# EAGLE schematic TiltyDuo (EAGLE 6.4)
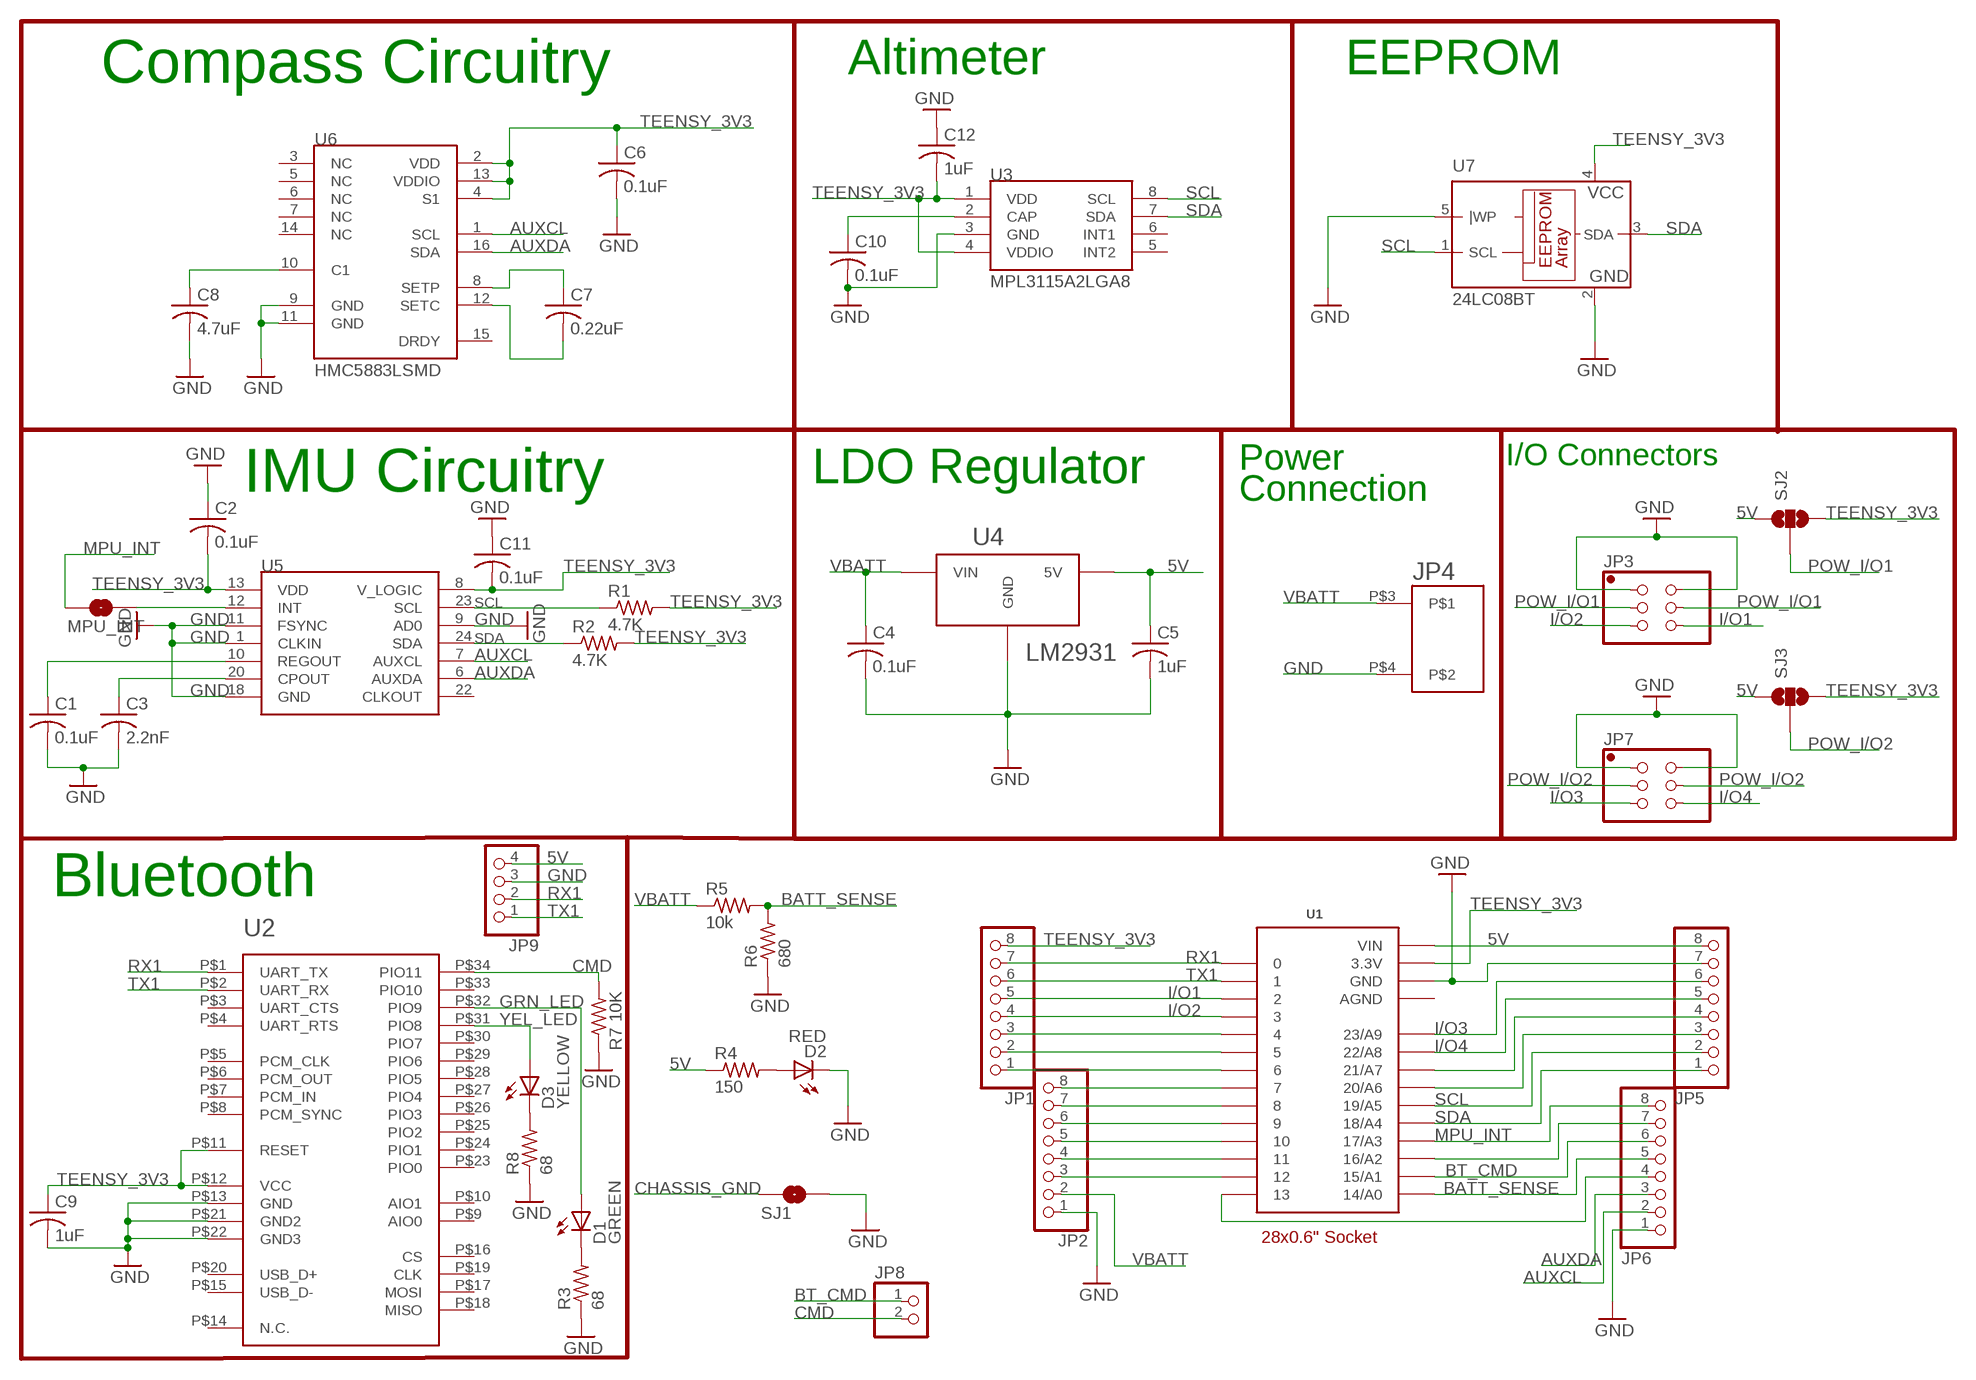
[diagram p0: schematic, sheet 1]

## Parts
C1  0.1uF  C-USC0603  [C0603]
C2  0.1uF  C-USC0603  [C0603]
C3  2.2nF  C-USC0603  [C0603]
C4  0.1uF  C-USC0603  [C0603]
C5  1uF  C-USC0603  [C0603]
C6  0.1uF  C-USC0603  [C0603]
C7  0.22uF  C-USC0603  [C0603]
C8  4.7uF  C-USC0603  [C0603]
C9  1uF  C-USC0603  [C0603]
C10  0.1uF  C-USC0603  [C0603]
C11  0.1uF  C-USC0603  [C0603]
C12  1uF  C-USC0603  [C0603]
D1  GREEN  LED-GREENLED-0805_NO_SILK  [LED-0805]
D2  RED  LED-GREENLED-0805_NO_SILK  [LED-0805]
D3  YELLOW  LED-GREENLED-0805_NO_SILK  [LED-0805]
JP1  PINHD-1X81X08_NO_SILK  [1X08_NO_SS]
JP2  PINHD-1X81X08_NO_SILK  [1X08_NO_SS]
JP3  PINHD-2X32X03_NO_SILK  [2X03_NO_SS]
JP4  2-POS_SMD_TERM_BLOCK  [2-POS_SMD_TERMINAL_BLOCK]
JP5  PINHD-1X81X08_NO_SILK  [1X08_NO_SS]
JP6  PINHD-1X81X08_NO_SILK  [1X08_NO_SS]
JP7  PINHD-2X32X03_NO_SILK  [2X03_NO_SS]
JP8  PINHD-1X21X02_NO_SILK  [1X02_NO_SS]
JP9  PINHD-1X4  [1X04]
MPU_INT  SOLDERJUMPERNO  [SJ_2S-NO]
R1  4.7K  R-US_R0402  [R0402]
R2  4.7K  R-US_R0402  [R0402]
R3  68  R-US_R0603  [R0603]
R4  150  R-US_R0603  [R0603]
R5  10k  R-US_R0603  [R0603]
R6  680  R-US_R0603  [R0603]
R7  10K  R-US_R0603  [R0603]
R8  68  R-US_R0603  [R0603]
SJ1  SOLDERJUMPERNO  [SJ_2S-NO]
SJ2  SOLDERJUMPER_2WAYS  [SJ_3]
SJ3  SOLDERJUMPER_2WAYS  [SJ_3]
U1  TEENSY_3.0_OUTER-PINS28-DIP_SOCKET  [28-DIP]
U2  HC-09_BREAKOUT  [HC-09_BREAKOUT]
U3  MPL3115A2LGA8  [LGA8]
U4  LM2931  [TO263]
U5  MPU-6050  [QFN-24]
U6  HMC5883LSMD  [16LPCC]
U7  24LC08BT  [SOT23-5L]

## Nets
5V: C5.1 JP5.8 JP9.4 R4.1 SJ2.1 SJ3.1 U1.P$15(VIN) U4.P$3(5V)
AUXCL [I/O]: JP6.2 U5.7(AUXCL) U6.1(SCL)
AUXDA [I/O]: JP6.3 U5.6(AUXDA) U6.16(SDA)
BATT_SENSE: JP6.5 R5.2 R6.2 U1.P$27(14/A0)
BT_CMD: JP6.6 JP8.1 U1.P$26(15/A1)
CHASSIS_GND: SJ1.1
CMD: JP8.2 R7.2 U2.P$34(PIO11)
GND: C1.2 C2.1 C3.2 C4.2 C5.2 C6.2 C8.2 C9.2 C10.2 C11.1 C12.1 D2.2(C) JP2.1 JP3.1 JP3.2 JP4.P$4 JP5.7 JP6.1 JP7.1 JP7.2 JP9.3 R3.1 R6.1 R7.1 R8.1 SJ1.2 U1.P$1(GND) U2.P$13(GND) U2.P$21(GND2) U2.P$22(GND3) U3.3(GND) U4.P$1(GND) U5.1(CLKIN) U5.9(AD0) U5.11(FSYNC) U5.18(GND) U6.9(GND) U6.11(GND) U7.2(GND) U7.5(|WP)
GRN_LED: D1.1(A) U2.P$32(PIO9)
I/O1: JP1.5 JP3.6 U1.P$4
I/O2: JP1.4 JP3.5 U1.P$5
I/O3: JP5.6 JP7.5 U1.P$18(23/A9)
I/O4: JP5.5 JP7.6 U1.P$19(22/A8)
MPU_INT: JP6.8 MPU_INT.1 U1.P$24(17/A3)
N$1: C1.1 U5.10(REGOUT)
N$2: C3.1 U5.20(CPOUT)
N$3: D1.2(C) R3.2
N$5: C7.1 U6.8(SETP)
N$6: C7.2 U6.12(SETC)
N$7: JP1.3 U1.P$6
N$8: JP1.2 U1.P$7
N$9: JP1.1 U1.P$8
N$10: JP6.4 U1.P$28
N$11: C8.1 U6.10(C1)
N$12: JP2.6 U1.P$11
N$13: JP2.5 U1.P$12
N$14: JP2.4 U1.P$13
N$15: JP2.3 U1.P$14
N$16: MPU_INT.2 U5.12(INT)
N$17: D2.1(A) R4.2
N$18: JP5.4 U1.P$20(21/A7)
N$19: JP5.3 U1.P$21(20/A6)
N$21: C10.1 U3.2(CAP)
N$23: JP6.7 U1.P$25(16/A2)
N$24: D3.2(C) R8.2
POW_I/O1: JP3.3 JP3.4 SJ2.2
POW_I/O2: JP7.3 JP7.4 SJ3.2
RX1: JP1.7 JP9.2 U1.P$2 U2.P$1(UART_TX)
RX3: JP2.8 U1.P$9
SCL [I/O]: JP5.2 R1.1 U1.P$22(19/A5) U3.8(SCL) U5.23(SCL) U7.1(SCL)
SDA [I/O]: JP5.1 R2.1 U1.P$23(18/A4) U3.7(SDA) U5.24(SDA) U7.3(SDA)
TEENSY_3V3 [3.3V]: C2.2 C6.1 C9.1 C11.2 C12.2 JP1.8 R1.2 R2.2 SJ2.3 SJ3.3 U1.P$17(3.3V) U2.P$11(RESET) U2.P$12(VCC) U3.1(VDD) U3.4(VDDIO) U5.8(V_LOGIC) U5.13(VDD) U6.2(VDD) U6.4(S1) U6.13(VDDIO) U7.4(VCC)
TX1: JP1.6 JP9.1 U1.P$3 U2.P$2(UART_RX)
TX3: JP2.7 U1.P$10
VBATT: C4.1 JP2.2 JP4.P$3 R5.1 U4.P$2(VIN)
YEL_LED: D3.1(A) U2.P$31(PIO8)
Unconnected: U2.P$3(UART_CTS) U2.P$4(UART_RTS) U2.P$5(PCM_CLK) U2.P$6(PCM_OUT) U2.P$7(PCM_IN) U2.P$8(PCM_SYNC) U2.P$9(AIO0) U2.P$10(AIO1) U2.P$14(N.C.) U2.P$15(USB_D-) U2.P$16(CS) U2.P$17(MOSI) U2.P$18(MISO) U2.P$19(CLK) U2.P$20(USB_D+) U2.P$23(PIO0) U2.P$24(PIO1) U2.P$25(PIO2) U2.P$26(PIO3) U2.P$27(PIO4) U2.P$28(PIO5) U2.P$29(PIO6) U2.P$30(PIO7) U2.P$33(PIO10) U3.5(INT2) U3.6(INT1) U5.22(CLKOUT) U6.3(NC) U6.5(NC) U6.6(NC) U6.7(NC) U6.14(NC) U6.15(DRDY)

## Notes on the sheet
- Compass Circuitry | Altimeter | EEPROM
- Power | I/O Connectors
- IMU Circuitry | LDO Regulator
- Connection
- Bluetooth
- 28x0.6" Socket

## Power pins joined to a net without a drawn wire
AGND: U1.P$16(AGND)

## Library data of the parts
C1 C6 C9 C10 = resistor:C-US: CAPACITOR, American symbol; RATED_VOLTAGE: 2
C2 C4 C5 C11 C12 = resistor:C-US: CAPACITOR, American symbol
C3 = resistor:C-US: CAPACITOR, American symbol; RATED_VOLTAGE: 50
C7 C8 = resistor:C-US: CAPACITOR, American symbol; ESR: <200mOhms
D1-D3 = SparkFun-LED:LED-GREEN: Various green LEDs 0603- DIO-00821 LARGE- DIO-00862 LILYPAD- DIO-09910
JP1 JP2 JP5 JP6 = pinhead:PINHD-1X8: PIN HEADER
JP3 JP7 = pinhead:PINHD-2X3: PIN HEADER
JP4 = My Parts:2-POS_SMD_TERM_BLOCK
JP8 = pinhead:PINHD-1X2: PIN HEADER
JP9 = pinhead:PINHD-1X4: PIN HEADER
MPU_INT SJ1 = SparkFun-Passives:SOLDERJUMPER: Solder Jumper Standard SMD solder jumper. Used to automate production. Two varients : Normally Open and Normally Closed are the same, but have different paste layers. NC will have a large amount of paste and should jumper during reflow.
R1-R8 = resistor:R-US_: RESISTOR, American symbol
SJ2 SJ3 = SparkFun-Passives:SOLDERJUMPER_2WAY: Solder Jumper 2 way solder jumper
U1 = My Parts:TEENSY_3.0_OUTER-PINS; COST: 0.28
U2 = csr:HC-09_BREAKOUT
U3 = SparkFun-Sensors:MPL3115A2: Altimeter/Pressure Sensor, I2C, 1.95V-3.6V supply, 50 to 110kPa
U4 = on-semiconductor:LM2931; COST: 0.53
U5 = SparkFun-Sensors:MPU-6050: MPU-6000 - I2C address is 0x68 with AD0 low and 0x69 with AD0 high.
U6 = SparkFun:HMC5883L: 3 Axis Digital Compass IC
U7 = microchip:24LC08BT